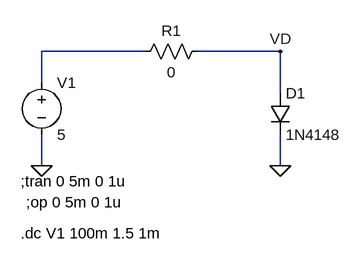
[diagram p0: schematic 1n4148-sim.asc]
1n4148-sim.asc, the LTspice schematic file:
Version 4
SHEET 1 880 680
WIRE 48 64 -112 64
WIRE 256 64 128 64
WIRE -112 112 -112 64
WIRE 256 128 256 64
WIRE -112 240 -112 192
WIRE 256 240 256 192
FLAG -112 240 0
FLAG 256 240 0
FLAG 256 64 VD
SYMBOL diode 240 128 R0
SYMATTR InstName D1
SYMATTR Value 1N4148
SYMBOL res 144 48 R90
WINDOW 0 0 56 VBottom 2
WINDOW 3 32 56 VTop 2
SYMATTR InstName R1
SYMATTR Value 0
SYMBOL voltage -112 96 R0
WINDOW 123 0 0 Left 0
WINDOW 39 0 0 Left 0
SYMATTR InstName V1
SYMATTR Value 5
TEXT -144 264 Left 2 !;tran 0 5m 0 1u
TEXT -136 296 Left 2 !;op 0 5m 0 1u
TEXT -144 344 Left 2 !.dc V1 100m 1.5 1m

The netlist it stands for:
* 1n4148-sim.asc
D1 VD 0 1N4148
R1 VD N001 0
V1 N001 0 5
.model D D
.lib standard.dio
;tran 0 5m 0 1u
;op 0 5m 0 1u
.dc V1 100m 1.5 1m
.backanno
.end